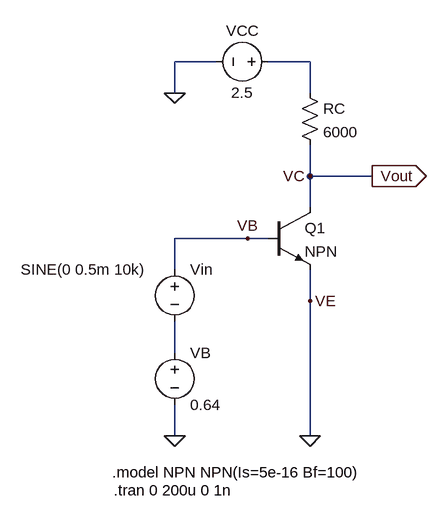
[diagram p0: schematic HW2 1-a.asc]
HW2 1-a.asc, the LTspice schematic file:
Version 4
SHEET 1 880 680
WIRE 208 -416 144 -416
WIRE 352 -416 288 -416
WIRE 144 -368 144 -416
WIRE 352 -368 352 -416
WIRE 352 -240 352 -288
WIRE 448 -240 352 -240
WIRE 352 -192 352 -240
WIRE 256 -144 144 -144
WIRE 288 -144 256 -144
WIRE 144 -96 144 -144
WIRE 352 -48 352 -96
WIRE 144 32 144 -16
WIRE 144 160 144 112
WIRE 352 160 352 -48
FLAG 144 160 0
FLAG 352 160 0
FLAG 448 -240 Vout
IOPIN 448 -240 Out
FLAG 144 -368 0
FLAG 256 -144 VB
FLAG 352 -48 VE
FLAG 352 -240 VC
SYMBOL voltage 144 16 R0
SYMATTR InstName VB
SYMATTR Value 0.64
SYMBOL voltage 144 -112 R0
WINDOW 3 -237 16 Left 2
WINDOW 123 0 0 Left 0
WINDOW 39 0 0 Left 0
SYMATTR InstName Vin
SYMATTR Value SINE(0 0.5m 10k)
SYMBOL npn 288 -192 R0
SYMATTR InstName Q1
SYMBOL res 336 -384 R0
SYMATTR InstName RC
SYMATTR Value 6000
SYMBOL voltage 304 -416 R90
WINDOW 0 -32 56 VBottom 2
WINDOW 3 32 56 VTop 2
SYMATTR InstName VCC
SYMATTR Value 2.5
TEXT 48 216 Left 2 !.model NPN NPN(Is=5e-16 Bf=100)
TEXT 50 244 Left 2 !.tran 0 200u 0 1n

The netlist it stands for:
* HW2 1-a.asc
VB N002 0 0.64
Vin VB N002 SINE(0 0.5m 10k)
Q1 VC VB 0 0 NPN
RC N001 VC 6000
VCC N001 0 2.5
.model NPN NPN
.model PNP PNP
.lib standard.bjt
.model NPN NPN(Is=5e-16 Bf=100)
.tran 0 200u 0 1n
.backanno
.end